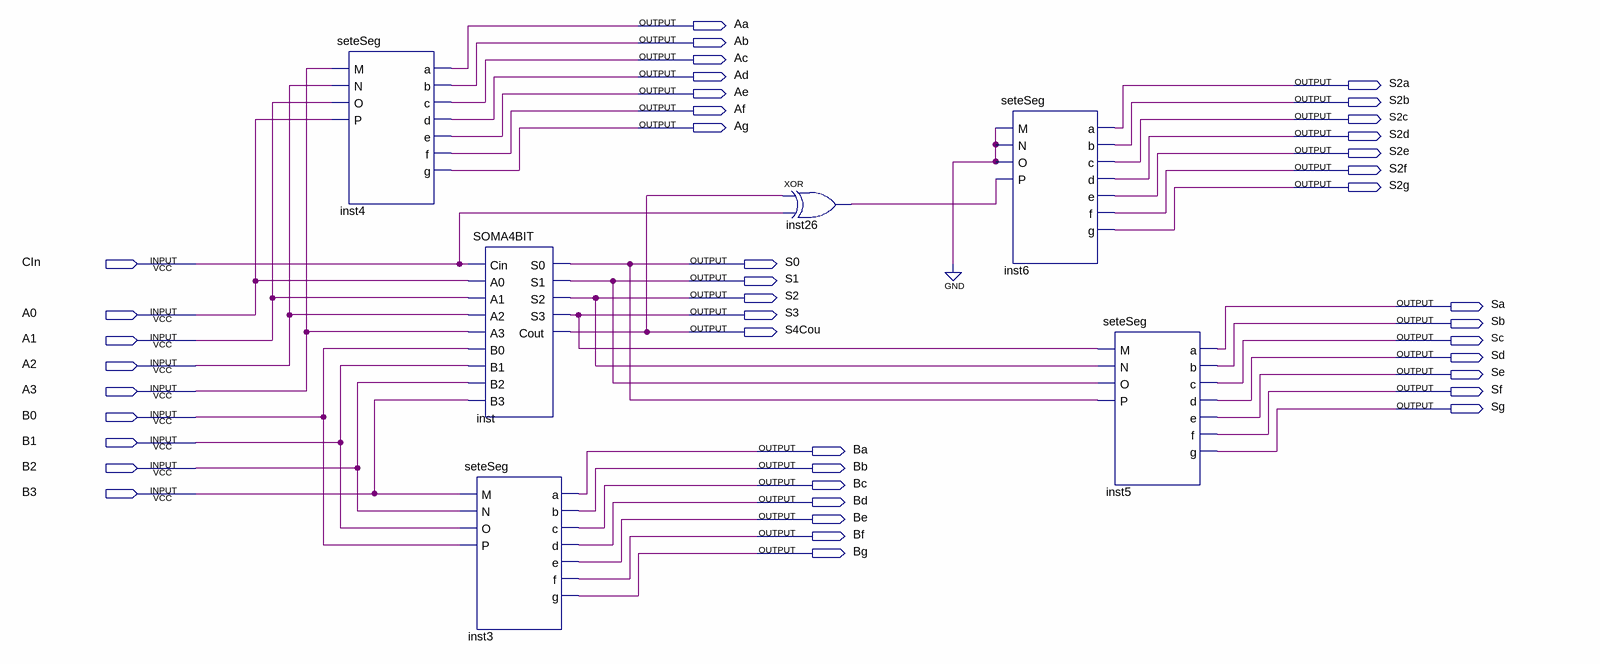
[diagram p0: schematic sheet]
// Quartus schematic Lab_1_Somador_4_bits_7seg.bdf as structural Verilog: 6 symbols, 42 pins
module Lab_1_Somador_4_bits_7seg (
  input  CIn,
  input  A0,
  input  A1,
  input  A2,
  input  A3,
  input  B0,
  input  B1,
  input  B2,
  input  B3,
  output Aa,
  output Ab,
  output Ac,
  output Ad,
  output S2a,
  output Ae,
  output S2b,
  output Af,
  output S2c,
  output Ag,
  output S2d,
  output S2e,
  output S2f,
  output S2g,
  output S0,
  output S1,
  output S2,
  output Sa,
  output S3,
  output Sb,
  output S4Cou,
  output Sc,
  output Sd,
  output Se,
  output Sf,
  output Sg,
  output Ba,
  output Bb,
  output Bc,
  output Bd,
  output Be,
  output Bf,
  output Bg
);

  wire inst26_out;

  seteSeg inst4 (.M(A3), .N(A2), .O(A1), .P(A0), .a(Aa), .b(Ab), .c(Ac), .d(Ad), .e(Ae), .f(Af), .g(Ag));
  SOMA4BIT inst (
    .Cin(CIn), .A0(A0), .A1(A1), .A2(A2), .A3(A3), .B0(B0), .B1(B1), .B2(B2), .B3(B3), .S0(S0), .S1(S1),
    .S2(S2), .S3(S3), .Cout(S4Cou));
  seteSeg inst3 (.M(B3), .N(B2), .O(B1), .P(B0), .a(Ba), .b(Bb), .c(Bc), .d(Bd), .e(Be), .f(Bf), .g(Bg));
  xor inst26 (inst26_out, S4Cou, CIn);
  seteSeg inst6 (
    .M(1'b0), .N(1'b0), .O(1'b0), .P(inst26_out), .a(S2a), .b(S2b), .c(S2c), .d(S2d), .e(S2e), .f(S2f),
    .g(S2g));
  seteSeg inst5 (.M(S3), .N(S2), .O(S1), .P(S0), .a(Sa), .b(Sb), .c(Sc), .d(Sd), .e(Se), .f(Sf), .g(Sg));
endmodule
